# Altium schematic sheet LPS.SchDoc
size A3; SheetNumber: 8; SheetTotal: 8
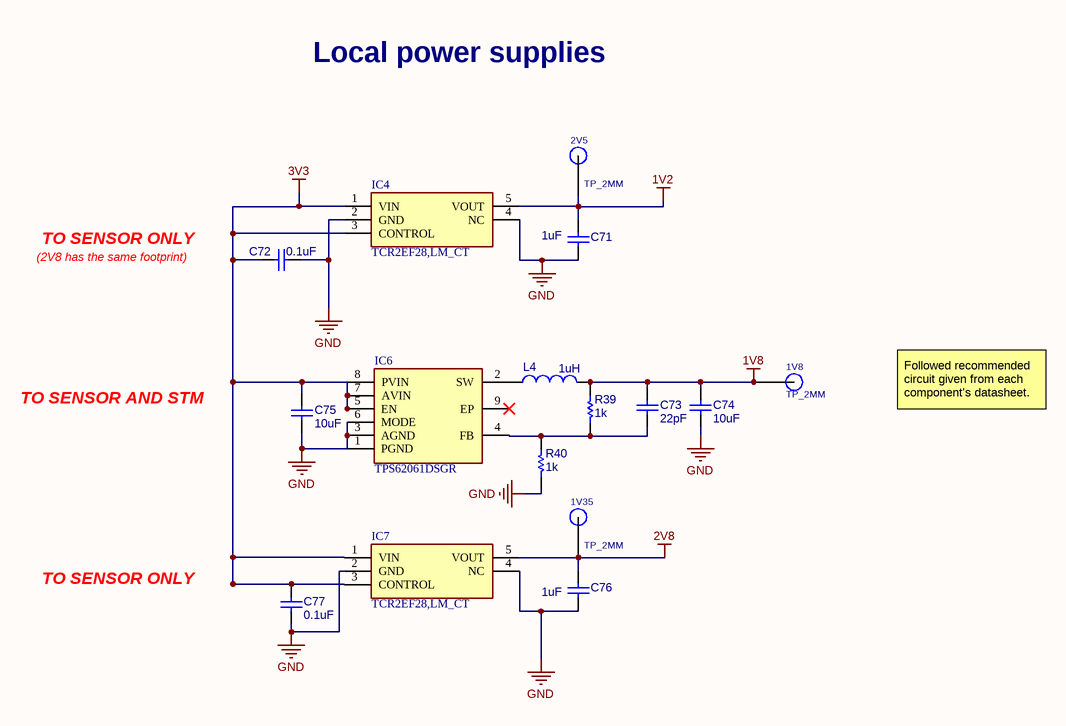
[diagram p0: LPS.SchDoc]

## Parts
1V8  TP_2MM  [TESTPOINT 2MM]
1V35  TP_2MM  [TESTPOINT 2MM]
2V5  TP_2MM  [TESTPOINT 2MM]
C71  value 1uF  [C0603]  (hidden comment: MCD-00237)
C72  value 0.1uF  [C0603]  (hidden comment: MCD-00237)
C73  value 22pF  [C0603]  (hidden comment: MCD-00237)
C74  value 10uF  [C0603]  (hidden comment: MCD-00237)
C75  value 10uF  [C0603]  (hidden comment: MCD-00237)
C76  value 1uF  [C0603]  (hidden comment: MCD-00237)
C77  value 0.1uF  [C0603]  (hidden comment: MCD-00237)
IC4  TCR2EF28,LM_CT  [TCR2EF28,LM_CT]
IC6  TPS62061DSGR  [TPS62061DSGR]
IC7  TCR2EF28,LM_CT  [TCR2EF28,LM_CT]
L4  1uH  [INDC1608X90X30LL10T20]
R39  value 1k  [RESC1608X55X25ML10T15-1]  (hidden comment: Resistor 10k +/-1% 0603 100mW)
R40  value 1k  [RESC1608X55X25ML10T15-1]  (hidden comment: Resistor 10k +/-1% 0603 100mW)

## Nets
1V2: 2V5.TP(TP_2MM) C71.2 IC4.5(VOUT)
1V8: 1V8.TP(TP_2MM) C73.1 C74.1 L4.2 R39.1
2V8: 1V35.TP(TP_2MM) C76.2 IC7.5(VOUT)
3V3: C72.2 C75.1 C77.1 IC4.1(VIN) IC4.3(CONTROL) IC6.5(EN) IC6.7(AVIN) IC6.8(PVIN) IC7.1(VIN) IC7.3(CONTROL)
GND: C71.1 C72.1 C74.2 C75.2 C76.1 C77.2 IC4.2(GND) IC4.4(NC) IC6.1(PGND) IC6.3(AGND) IC6.6(MODE) IC7.2(GND) IC7.4(NC) R40.1
NetC73_2: C73.2 IC6.4(FB) R39.2 R40.2
NetIC6_2: IC6.2(SW) L4.1

Not connected (* = marked no-connect by the designer): IC6 9(EP)*

## Notes on the sheet
- Local power supplies
- (2V8 has the same footprint)
- TO SENSOR ONLY
- TO SENSOR AND STM
- Followed recommended circuit given from each component's datasheet.

## Library data of the parts
C71-C77 = CMP-112-000001-1: Capacitor, MLCC, 100nF, 6V3, X5R, 10%, 0603, T=0,8mm; Manufacturer Part Number: CC0603KRX5R5BB104; Manufacturer: YAGEO; ECCN_EU: NEC; Provided_By: SUBCO; ECCN_US: EAR99; Status: Released; ComponentLink1Description: Datasheet; Component Type: Capacitors; Pin Count: 2; Package: C0603; Source: MB1364.SCHLIB; Design Item ID: MCD-00237; Part_Type: Capacitor; Internal_Part_Number: MCD-00237; ComponentLink1URL: http://tunmcdsvn.tun.st.com/Component_Datasheet_Library/Trunk/Capacitors/Yageo_Multilayer_capacitor_X5R_series_100pF_to_100uF; Manufacturer_Part_Number: CC0603KRX5R5BB104
IC4 IC7 = TCR2EF28,LM_CT: Integrated Circuit; Manufacturer_Name: Toshiba; Manufacturer_Part_Number: TCR2EF28,LM(CT; Datasheet Link: https://toshiba.semicon-storage.com/info/docget.jsp?did=13794&prodName=TCR2EF28; Height: 1.4mm; Mouser Part Number: 757-TCR2EF28LMCT; Mouser Price/Stock: https://www.mouser.co.uk/ProductDetail/Toshiba/TCR2EF28LMCT?qs=cW4DzVrAanOy43sfBSrpyQ%3D%3D; Arrow Part Number: TCR2EF28,LM(CT; Arrow Price/Stock: https://www.arrow.com/en/products/tcr2ef28lm-ct/toshiba?utm_currency=USD&region=nac
IC6 = TPS62061DSGR: Integrated Circuit; Manufacturer_Name: Texas Instruments; Datasheet Link: http://www.ti.com/lit/gpn/TPS62061; Height: 0.8mm; Manufacturer_Part_Number: TPS62061DSGR; Mouser Part Number: 595-TPS62061DSGR; Mouser Price/Stock: https://www.mouser.com/Search/Refine.aspx?Keyword=595-TPS62061DSGR; Arrow Part Number: TPS62061DSGR; Arrow Price/Stock: https://www.arrow.com/en/products/tps62061dsgr/texas-instruments
L4 = CMP-2000-05913-1: Unshielded Wirewound Inductor, 33 nH, 350 mA, -55 to 150 degC, 0603 (1608 Metric), RoHS, Tape and Reel; Manufacturer: EPCOS-(TDK); Q @ Freq: 14@100MHz; Inductance: 33nH; Material - Core: Ceramic; Frequency - Self Resonant: 3GHz; DC Resistance (DCR): 600mOhmMax; Tolerance: ±5%; Frequency - Test: 100MHz; Current Rating: 350mA; Manufacturer URL: http://www.tdk.com/; Type: Wirewound; Mounting Type: SurfaceMount; Mounting Technology: SurfaceMount; Height - Seated (Max): 0.035"(0.90mm); Datasheet URL: https://en.tdk.eu/inf/30/db/ind_2008/b82496c.pdf; Shielding: Unshielded; Operating Temperature: -; Size / Dimension: 0.063"Lx0.031"W(1.60mmx0.80mm); Series: SIMID; Current - Saturation: -; Ratings: AEC-Q200; Packaging: CutTape(CT); Package Reference: 0603; Datasheet Version: 07/2016; Category: Inductors,Coils,Chokes; Package Description: 2-Pin Surface Mount Device, Body 1.6 x 0.8 mm; Family: FixedInductors; Package / Case: 0603(1608Metric)
R39 R40 = CMP-009-00181-1: Chip Resistor, 10k Ohm, 0.1 W, -55 to 155 degC, 0603 (1608 Metric); Voltage Rating: 50V; Tolerance: 1%; Source: Components - 14.11.22 - 11.28.SchLib; Design Item ID: CMP-009-00006-5; Created by: Micah Randall; Power: 100mW; Max Operating Temperature: 155°C; RoHS Compliant: Yes; Mounting Technology: SM; Case/Package: 0603; Min Operating Temperature: -55°C; Pins: 2